# EAGLE design doppelshift2 (EAGLE 7.7.0)
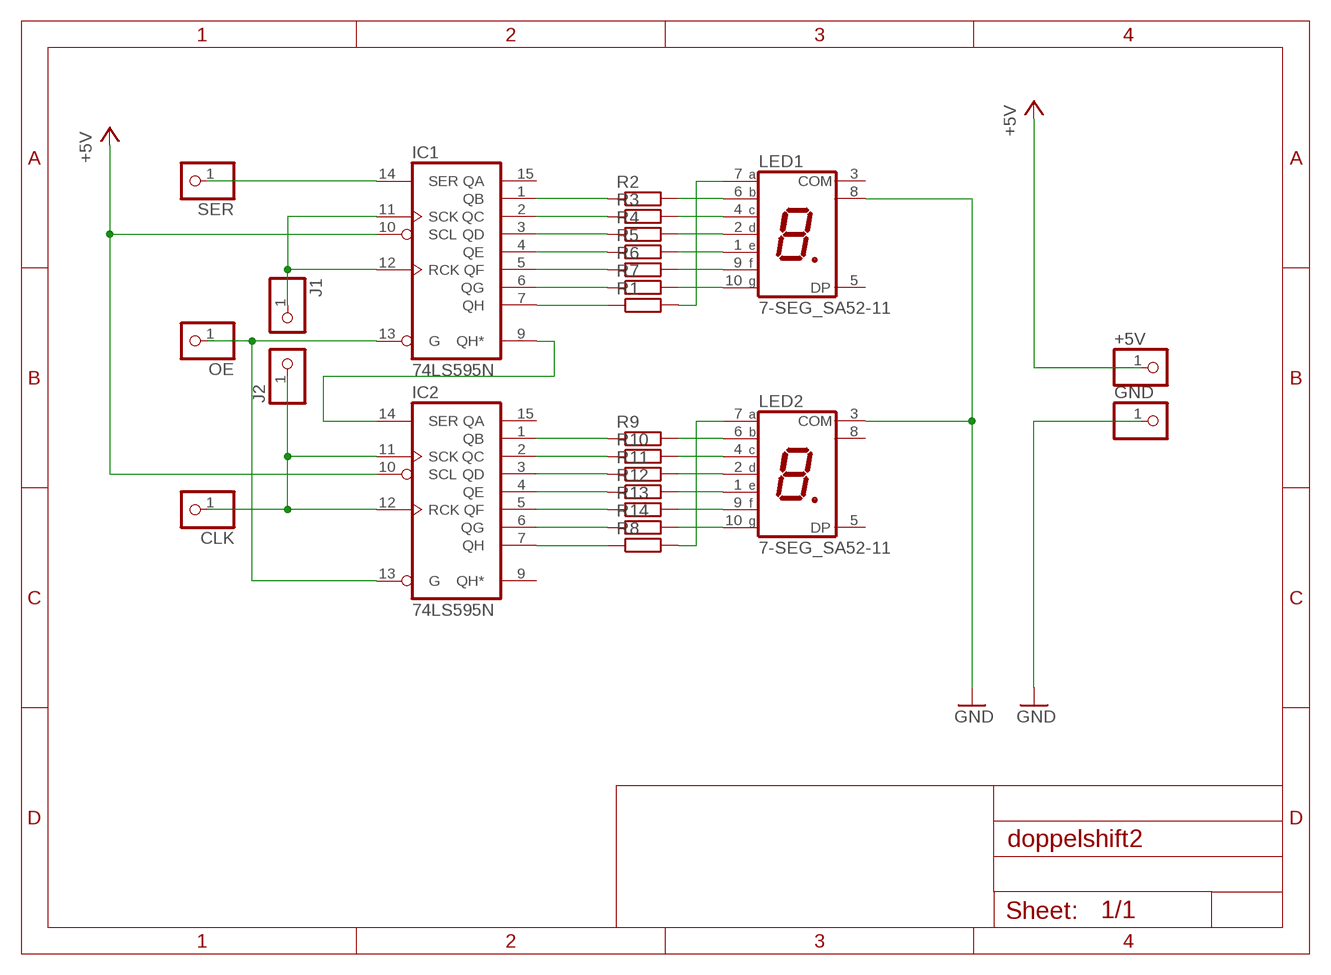
[diagram p0: schematic, sheet 1]

## Parts
+5V  PINHD-1X1  [1X01]
CLK  PINHD-1X1  [1X01]
GND  PINHD-1X1  [1X01]
IC1  74LS595N  [DIL16]
IC2  74LS595N  [DIL16]
J1  PINHD-1X1  [1X01]
J2  PINHD-1X1  [1X01]
LED1  7-SEG_SA52-11  [SA52-11]
LED2  7-SEG_SA52-11  [SA52-11]
OE  PINHD-1X1  [1X01]
R1  R-EU_0309/10  [0309/10]
R2  R-EU_0309/10  [0309/10]
R3  R-EU_0309/10  [0309/10]
R4  R-EU_0309/10  [0309/10]
R5  R-EU_0309/10  [0309/10]
R6  R-EU_0309/10  [0309/10]
R7  R-EU_0309/10  [0309/10]
R8  R-EU_0309/10  [0309/10]
R9  R-EU_0309/10  [0309/10]
R10  R-EU_0309/10  [0309/10]
R11  R-EU_0309/10  [0309/10]
R12  R-EU_0309/10  [0309/10]
R13  R-EU_0309/10  [0309/10]
R14  R-EU_0309/10  [0309/10]
SER  PINHD-1X1  [1X01]

## Nets
CLK1: IC1.11(SCK) IC1.12(RCK) J1.1
CLK2: CLK.1 IC2.11(SCK) IC2.12(RCK) J2.1
GND: GND.1 LED1.8(COM) LED2.3(COM)
N$1: IC2.7(QH) R8.1
N$2: IC1.1(QB) R2.1
N$3: IC1.2(QC) R3.1
N$4: IC1.3(QD) R4.1
N$5: IC1.4(QE) R5.1
N$6: IC1.5(QF) R6.1
N$7: IC1.6(QG) R7.1
N$8: LED2.7(A) R8.2
N$9: IC2.1(QB) R9.1
N$10: IC2.2(QC) R10.1
N$11: IC2.3(QD) R11.1
N$12: IC2.4(QE) R12.1
N$13: IC2.5(QF) R13.1
N$14: IC2.6(QG) R14.1
N$17: IC1.14(SER) SER.1
N$18: IC1.7(QH) R1.1
N$19: LED1.6(B) R2.2
N$20: LED1.4(C) R3.2
N$21: LED1.2(D) R4.2
N$22: LED1.1(E) R5.2
N$23: LED1.9(F) R6.2
N$24: LED1.10(G) R7.2
N$25: LED1.7(A) R1.2
N$26: LED2.6(B) R9.2
N$27: LED2.4(C) R10.2
N$28: LED2.2(D) R11.2
N$29: LED2.1(E) R12.2
N$30: LED2.9(F) R13.2
N$31: LED2.10(G) R14.2
OE: IC1.13(G) IC2.13(G) OE.1
UBERTRAG: IC1.9(QH*) IC2.14(SER)
VCC: +5V.1 IC1.10(SCL) IC2.10(SCL) ; supply symbol labelled +5V
Unconnected: IC1.15(QA) IC2.9(QH*) IC2.15(QA) LED1.3(COM) LED1.5(DP) LED2.5(DP) LED2.8(COM)

## Power pins joined to a net without a drawn wire
GND: IC1.8(GND) IC2.8(GND)
VCC: IC1.16(VCC) IC2.16(VCC)

## Library data of the parts
+5V CLK GND J1 J2 OE SER = pinhead:PINHD-1X1: PIN HEADER
IC1 IC2 = 74xx-us:74*595: 8-bit SHIFT REGISTER, output latch
LED1 LED2 = display-kingbright:7-SEG_: Kingbright 14.2mm (0.56 INCH) SINGLE DIGIT NUMERIC DUISPLAY Source: SA56-11EWA(Ver1189471036.pdf; OC_FARNELL: unknown; OC_NEWARK: unknown
R1-R14 = rcl:R-EU_: RESISTOR, European symbol

## Board
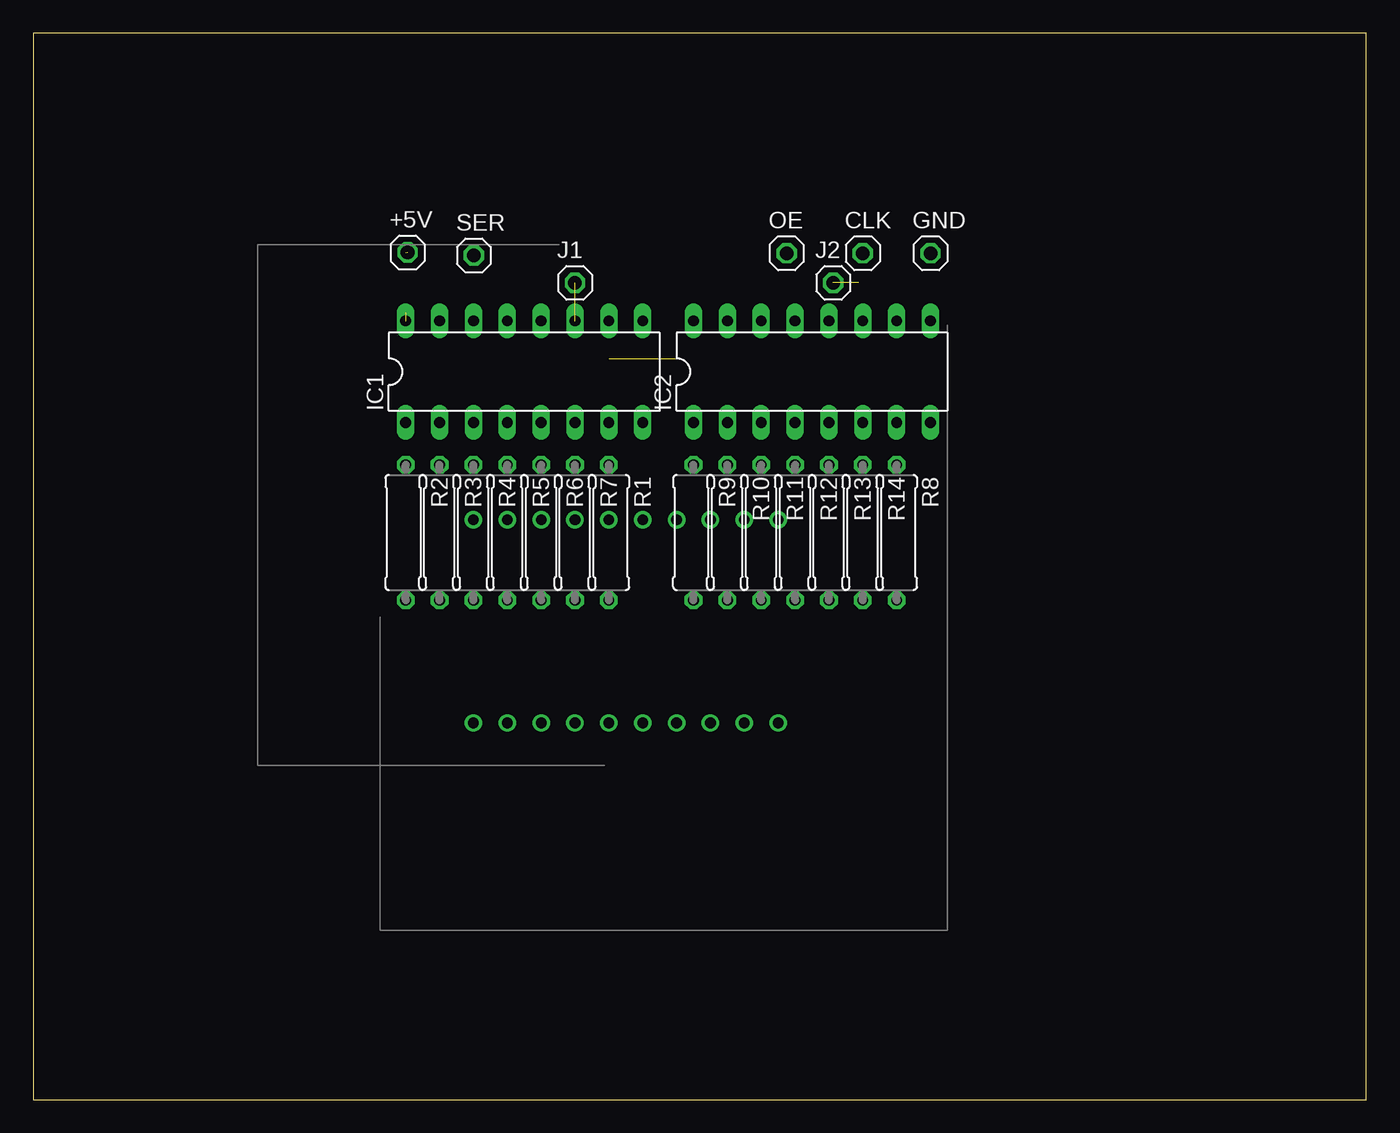
[diagram p1: board, top side]
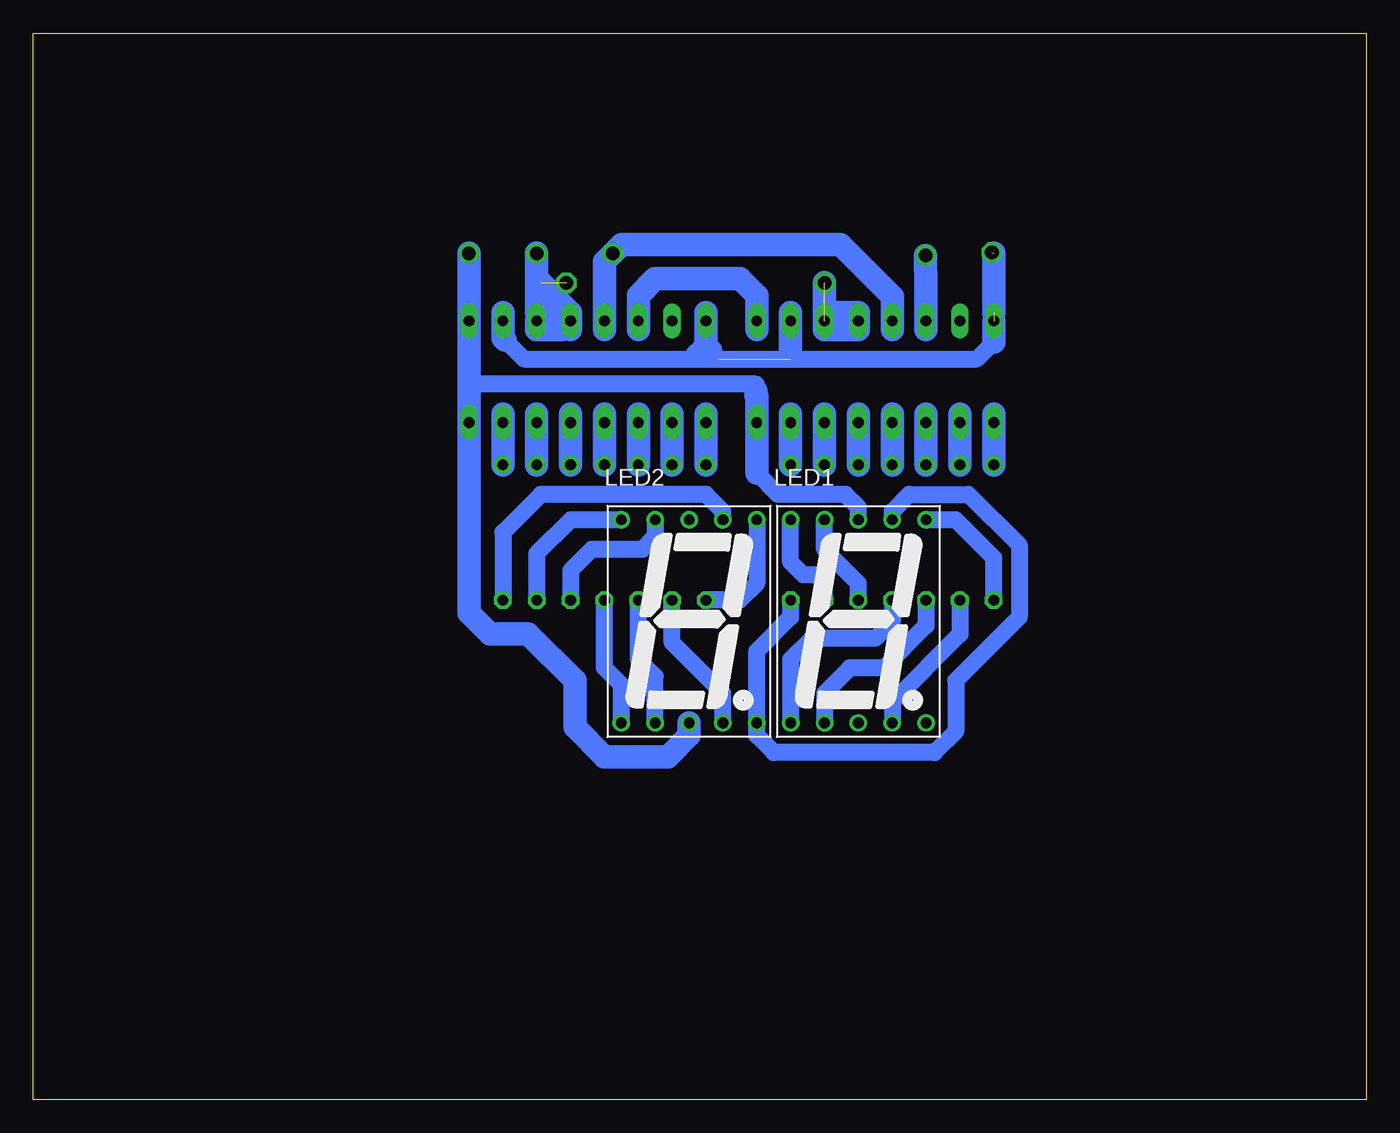
[diagram p2: board, bottom side, seen from below]

Size 100 x 80 mm. Coordinates in mm from the lower left corner, seen from the top.
Outline: 0,0 100,0 100,80 0,80 0,0
Copper layers (1*16): Top 0.035mm / dielectric 1.5mm / Bottom 0.035mm
Design rules "default": minimum track width 10mil, minimum drill 24mil, track to track 8mil, track to pad 8mil, pad to pad 8mil, via to via 8mil, smd to smd 8mil, copper to edge 40mil, drill to drill 8mil, minimum pad ring 10mil, minimum via ring 8mil, stop-mask expansion 4mil, vias tented up to drill 0mil, thermal gap 10mil

### Footprints (pad centres in the part's own frame; a part is rotated, then mirrored left to right if it is on the bottom)
1X01 = drill 1.016 octagon: 1 0,0
DIL16 = drill 0.813 long: 1 -8.89,-3.81; 2 -6.35,-3.81; 3 -3.81,-3.81; 4 -1.27,-3.81; 5 1.27,-3.81; 6 3.81,-3.81; 7 6.35,-3.81; 8 8.89,-3.81; 9 8.89,3.81; 10 6.35,3.81; 11 3.81,3.81; 12 1.27,3.81; 13 -1.27,3.81; 14 -3.81,3.81; 15 -6.35,3.81; 16 -8.89,3.81
SA52-11 = drill 0.8: 1 -5.08,-7.62; 2 -2.54,-7.62; 3 0,-7.62; 4 2.54,-7.62; 5 5.08,-7.62; 6 5.08,7.62; 7 2.54,7.62; 8 0,7.62; 9 -2.54,7.62; 10 -5.08,7.62
0309/10 = drill 0.813 octagon: 1 -5.08,0; 2 5.08,0

### Placement (x,y rotation side)
+5V  28.08,63.56 0 top
CLK  62.23,63.5 0 top
GND  67.31,63.5 0 top
IC1  36.83,54.61 0 top
IC2  58.42,54.61 0 top
J1  40.64,61.28 0 top
J2  60.01,61.28 0 top
LED1  38.1,35.88 0 bottom
LED2  50.8,35.88 0 bottom
OE  56.52,63.5 0 top
R1  43.18,42.55 270 top
R2  27.94,42.55 270 top
R3  30.48,42.55 270 top
R4  33.02,42.55 270 top
R5  35.56,42.55 270 top
R6  38.1,42.55 270 top
R7  40.64,42.55 270 top
R8  64.77,42.55 270 top
R9  49.53,42.55 270 top
R10  52.07,42.55 270 top
R11  54.61,42.55 270 top
R12  57.15,42.55 270 top
R13  59.69,42.55 270 top
R14  62.23,42.55 270 top
SER  33.05,63.33 0 top

### Tracks (layer width: path | path; a pad name or v marks a point on that pad's centre or on a via)
CLK1  (1 unrouted)
  Bottom 1.778: 38.1,59.05 IC1.12 38.1,57.78 40.64,57.78 40.64,59.05 | 38.42,59.05 40.64,59.05 | 40.64,59.05 J1.1
CLK2  (1 unrouted)
  Bottom 1.778: IC2.11 62.23,57.78 60.33,57.78 IC2.12 | 59.69,57.78 IC2.12 | IC2.12 59.69,59.05 | 59.69,59.05 62.23,59.05 CLK.1 | 59.69,59.05 61.91,61.28
GND
  Bottom 1.27: LED1.8 38.1,44.45 39.05,45.4 44.13,45.4 45.72,46.99 | IC2.8 67.38,50.87 67.38,52.98 66.69,53.66 45.78,53.66 45.78,53.15
  Bottom 1.778: 45.72,51.44 IC1.8 | 67.31,51.44 IC2.8 | IC1.8 45.72,46.99 | IC2.8 67.31,50.16 67.31,36.51 65.72,34.92 62.87,34.92 59.37,31.43 59.37,27.94 57.15,25.72 52.39,25.72 50.8,27.3 LED2.3 | IC1.8 45.72,52.75 45.78,52.81 45.78,53.15 | GND.1 IC2.8
N$1
  Bottom 1.778: R8.1 IC2.7 64.77,51.44
N$2
  Bottom 1.778: R2.1 IC1.1 27.94,51.44
N$3
  Bottom 1.778: R3.1 IC1.2 30.48,51.44
N$4
  Bottom 1.778: R4.1 IC1.3 33.02,51.44
N$5
  Bottom 1.778: R5.1 IC1.4 35.56,51.44
N$6
  Bottom 1.778: R6.1 IC1.5 38.1,51.44
N$7
  Bottom 1.778: R7.1 IC1.6 40.64,51.44
N$8
  Bottom 1.27: LED2.7 48.26,44.13 49.53,45.4 61.91,45.4 64.77,42.55 R8.2
N$9
  Bottom 1.778: R9.1 IC2.1 49.53,51.44
N$10
  Bottom 1.778: R10.1 IC2.2 52.07,51.44
N$11
  Bottom 1.778: R11.1 IC2.3 54.61,51.44
N$12
  Bottom 1.778: R12.1 IC2.4 57.15,51.44
N$13
  Bottom 1.778: R13.1 IC2.5 59.69,51.44
N$14
  Bottom 1.778: R14.1 IC2.6 62.23,51.44
N$17
  Bottom 1.778: 33.02,57.78 IC1.14 33.02,60.96 SER.1
N$18
  Bottom 1.778: R1.1 IC1.7 43.18,51.44
N$19
  Bottom 1.27: R2.2 27.94,40.64 30.8,43.5 LED1.6
N$20
  Bottom 1.27: R3.2 30.48,34.92 35.56,29.84 LED1.4
N$21
  Bottom 1.27: R4.2 33.02,35.56 36.2,32.38 38.73,32.38 40.64,30.48 LED1.2
N$22
  Bottom 1.27: R5.2 35.56,35.88 36.83,34.61 41.59,34.61 43.18,33.02 LED1.1
N$23
  Bottom 1.27: R6.2 38.1,38.73 40.64,41.27 LED1.9
N$24
  Bottom 1.27: R7.2 40.64,38.73 41.27,39.37 42.23,39.37 43.18,40.32 LED1.10
N$25
  Bottom 1.27: R1.2 43.18,36.2 45.72,33.66 45.72,27.3 44.45,26.04 32.38,26.04 30.8,27.62 30.8,31.43 26.04,36.2 26.04,41.59 29.84,45.4 34.29,45.4 35.56,44.13 LED1.7
N$26
  Bottom 1.27: LED2.6 45.72,38.73 46.99,37.47 R9.2
N$27
  Bottom 1.27: LED2.4 48.26,30.48 52.07,34.29 R10.2
N$28
  Bottom 1.27: LED2.2 53.34,31.75 54.61,33.02 R11.2
N$29
  Bottom 1.27: LED2.1 55.88,31.11 57.15,32.38 R12.2
N$30
  Bottom 1.27: LED2.9 53.34,42.23 54.29,41.27 58.1,41.27 59.69,39.69 R13.2
N$31
  Bottom 1.27: LED2.10 59.69,43.5 62.23,40.96 R14.2
OE
  Bottom 1.778: 35.56,57.78 IC1.13 35.56,60.25 39.45,64.14 55.88,64.14 56.2,63.82 OE.1 57.15,62.87 IC2.13 57.15,57.78
UBERTRAG
  Bottom 1.778: 45.72,57.78 IC1.9 45.72,60.33 46.99,61.59 53.34,61.59 54.61,60.33 IC2.14 54.61,57.78
VCC  (3 unrouted)
  Bottom 1.27: 49.53,56.52 49.21,56.2 48.58,55.56 29.21,55.56 27.94,56.83 | 64.61,56.99 63.18,55.56 43.18,55.56 43.18,55.88
  Bottom 1.778: 49.53,59.05 IC2.16 49.53,55.88 50.16,55.88 49.85,56.2 49.21,56.2 | IC1.16 27.94,56.83 | 27.94,59.05 27.94,63.5 | 43.18,59.05 IC1.10 43.18,55.88 | 64.77,59.05 IC2.10 64.77,57.15 64.61,56.99